# Altium schematic sheet PowerSupply.SchDoc
size A
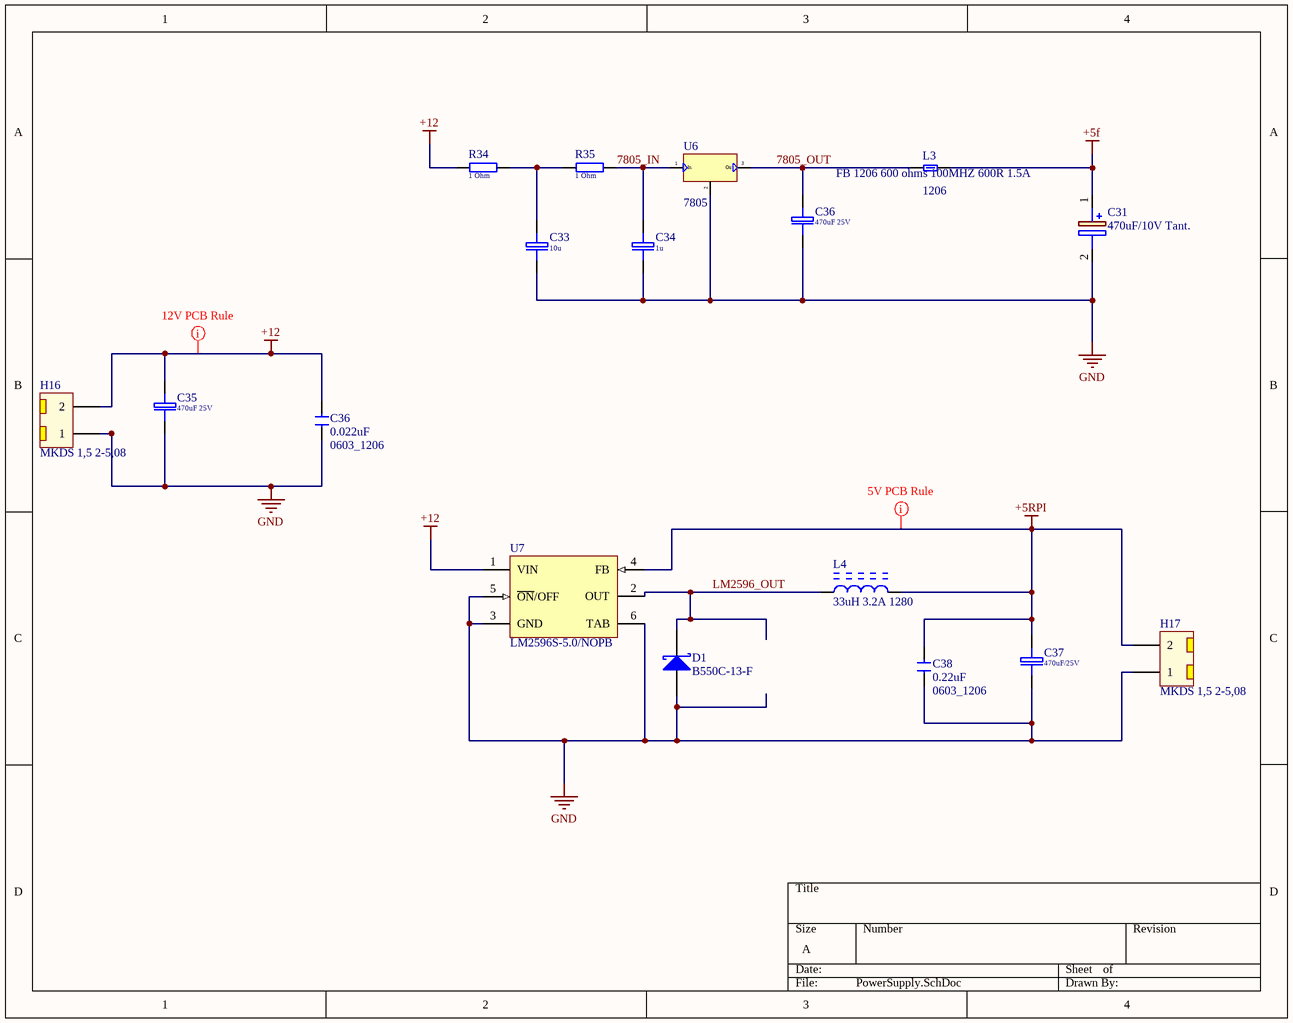
[diagram p0: PowerSupply.SchDoc]

## Parts
(Parts that share a designator on the sheet are numbered #1, #2 ... from top to bottom, then left to right.)
C31  470uF/10V Tant.  [SMD_2917]
C33  10u  [El-d5-h11-F2.54]
C34  1u  [El-d5-h11-F2.54]
C35  470uF 25V  [El-d8-h14-F3.81]
C36#1  470uF 25V  [El-d8-h14-F3.81]
C36#2  0.022uF  value 0603_1206  [SMD_CHIP_CAP_CER_0603_TO_1206]
C37  470uF/25V  [El-d8-h14-F3.81]
C38  0.22uF  value 0603_1206  [SMD_CHIP_CAP_CER_0603_TO_1206]
D1  B550C-13-F  [DIOD-SMC-2-A_V]
H16  MKDS 1,5 2-5,08  [MKDS 1,5 2-5,08]
H17  MKDS 1,5 2-5,08  [MKDS 1,5 2-5,08]
L3  FB 1206 600 ohms 100MHZ 600R 1.5A  value 1206  [SMD_CHIP_FERRITE_1206]
L4  33uH 3.2A 1280  [BOUR-SRR1280-2_V]
R34  1 Ohm  [R0.25-400]
R35  1 Ohm  [R0.25-400]
U6  7805  [TO 220_DISIPADOR_HORIZONTAL_2]
U7  LM2596S-5.0/NOPB  [KTT0005B_M]

## Nets
+5f: C31.1(+) L3.2
+5RPI: C37.1 C38.2 H17.2 L4.2 U7.4(FB)
+12: C35.1 C36#2.2 H16.2 R34.1 U7.1(VIN)
GND: C31.2(-) C33.2 C34.2 C35.2 C36#1.2 C36#2.1 C37.2 C38.1 D1.1(A) H16.1 H17.1 U6.2(G) U7.3(GND) U7.5(~{ON}/OFF) U7.6(TAB)
7805_IN: C34.1 R35.2 U6.1(In)
7805_OUT: C36#1.1 L3.1 U6.3(Ou)
LM2596_OUT: D1.2(K) L4.1 U7.2(OUT)
NetC33_1: C33.1 R34.2 R35.1

## Layout directives
rule Width Constraint [Pref Width = 2mm    Min Width = 0.254mm    Max Width = 3mm]; net class *; rule Clearance Constraint [Clearance = 0.3mm]: +5RPI
rule Width Constraint [Pref Width = 1mm    Min Width = 0.254mm    Max Width = 2mm]: +12

## Library data of the parts
C31 = SMD_2917: T495X477K010ATE100; Manufacturer_Name: Kemet; Allied_Number: 70610894; Datasheet Link: http://www.kemet.com/Lists/ProductCatalog/Attachments/261/KEM_T2009_T495.pdf; Height: 3.1mm; Manufacturer_Part_Number: T495X477K010ATE100; Mouser Part Number: 80-T495X477K10ATE100; Mouser Price/Stock: https://www.mouser.com/Search/Refine.aspx?Keyword=80-T495X477K10ATE100; RS Part Number: 8015530P; RS Price/Stock: http://uk.rs-online.com/web/p/products/8015530P; Allied Price/Stock: https://www.alliedelec.com/kemet-t495x477k010ate100/70610894/
C33 C34 = 10u-35V: 35V; Price: 0.04
  C33: Value: 10u
  C34: Value: 1u
C35 C36#1 C37 = 470u-25V: 25V; Price: 0.15
  C35 C36#1: Value: 470uF 25V
  C37: Value: 470uF/25V
C36#2 C38 = SMD_CHIP_CAP_CER_0603_TO_1206
D1 = CMP-2000-05906-1: Schottky Barrier Rectifier / , 50 V, 5 A, -55 to 150 degC, 2-Pin SMD, RoHS, Tape and Reel; Unit Weight: 0.007408oz; Configuration: Single; Vrrm - Repetitive Reverse Voltage: 50V; Vf - Forward Voltage: 0.7V; If - Forward Current: 5A; Brand: DiodesIncorporated; Ifsm - Forward Surge Current: 100A; Ir - Reverse Current: 500uA; Datasheet URL: http://www.diodes.com/_files/datasheets/ds13012.pdf; Package Description: 2-Pin Surface Mount Device, Body 6.855 x 5.905 mm; Length: 7.11mm; Operating Temperature Range: -55Cto+125C; Series: B550; Mounting Style: SMD/SMT; Termination Style: SMD/SMT; Factory Pack Quantity: 3000; Packaging: Reel; Minimum Operating Temperature: -55C; Mounting Technology: SurfaceMount; RoHS: True; Manufacturer URL: http://www.diodes.com/; Width: 6.22mm; Technology: Si; Maximum Operating Temperature: +125C; Product Category: SchottkyDiodes&Rectifiers; Height: 2.5mm; Datasheet Version: Rev. 17-2, 07/2015; Package Reference: SMC; Product: SchottkyDiodes; Type: SchottkyBarrierRectifier; Manufacturer: DiodesIncorporated; Package / Case: SMC
H16 H17 = MKDS 1,5 2-5,08: PCB terminal block, nominal current: 17.5 A, nom. voltage: 400 V, pitch: 5.08 mm
L3 = CHIP_FERRITE_BEAD_INDUCTOR_1206: Chip Ferrite Bead Inductor
L4 = CMP-2000-07148-1: Shielded SMD Power Inductor, 33 uH, +/- 20%, -40 to 125 degC, 2-Pin SMD, RoHS, Tape and Reel; Manufacturer: Bourns; PartNumber: SRR1280; DC Resistance Max: 57MOhm; Maximum Self Resonant Frequency: 9.5MHz; DC Current Max: 3.5A; Inductance: 33000nH; Core Material: Ferrite; Minimum Quality Factor: 28; Maximum DC Resistance: 57mΩ; Datasheet Version: Rev. 03/15, 03/2015; Manufacturer URL: http://www.bourns.com/; Datasheet URL: http://www.bourns.com/docs/Product-Datasheets/SRR1280.pdf; Minimum Operating Temperature: -40°C; Package Description: 2-Pin Surface Mount Device, Body 12.5 x 12.5 mm; Maximum Operating Temperature: +125°C; Tolerance: 20%; Series: SRR1280; Package URL: http://www.bourns.com/docs/Product-Datasheets/SRR1280.pdf; Package Reference: SRR1280-2; Mounting Technology: SurfaceMount; Maximum DC Current: 3.5A
R34 R35 = R-0.25W: 0.25W 5% 250V; Price: 0.01; Value: 1 Ohm
U7 = CMP-0069-00269-3: SIMPLE SWITCHER® Power Converter 150 KHz 3A Step-Down Voltage Regulator, 5-pin TO-263, Pb-Free; Manufacturer: Texas Instruments; PowerWise: N; PackageTopMarking: NSUZXYTTE#*LM2596S*-5.0 P+; ComponentLink1URL: http://www.ti.com/general/docs/lit/getliterature.tsp?genericPartNumber=LM2596&fileType=pdf; PackageDescription: TO-263, Molded, .400 x .390 x .180in, 5 Lead, .067in Pitch, Surface Mount; RoHS: Y; PinCount: 5; Code_JEDEC: MO-169-AB; ComponentLink1Description: Datasheet URL; PackageReference: KTT0005B; CompType: Switcher
U6 = 7805: Price: 0.312